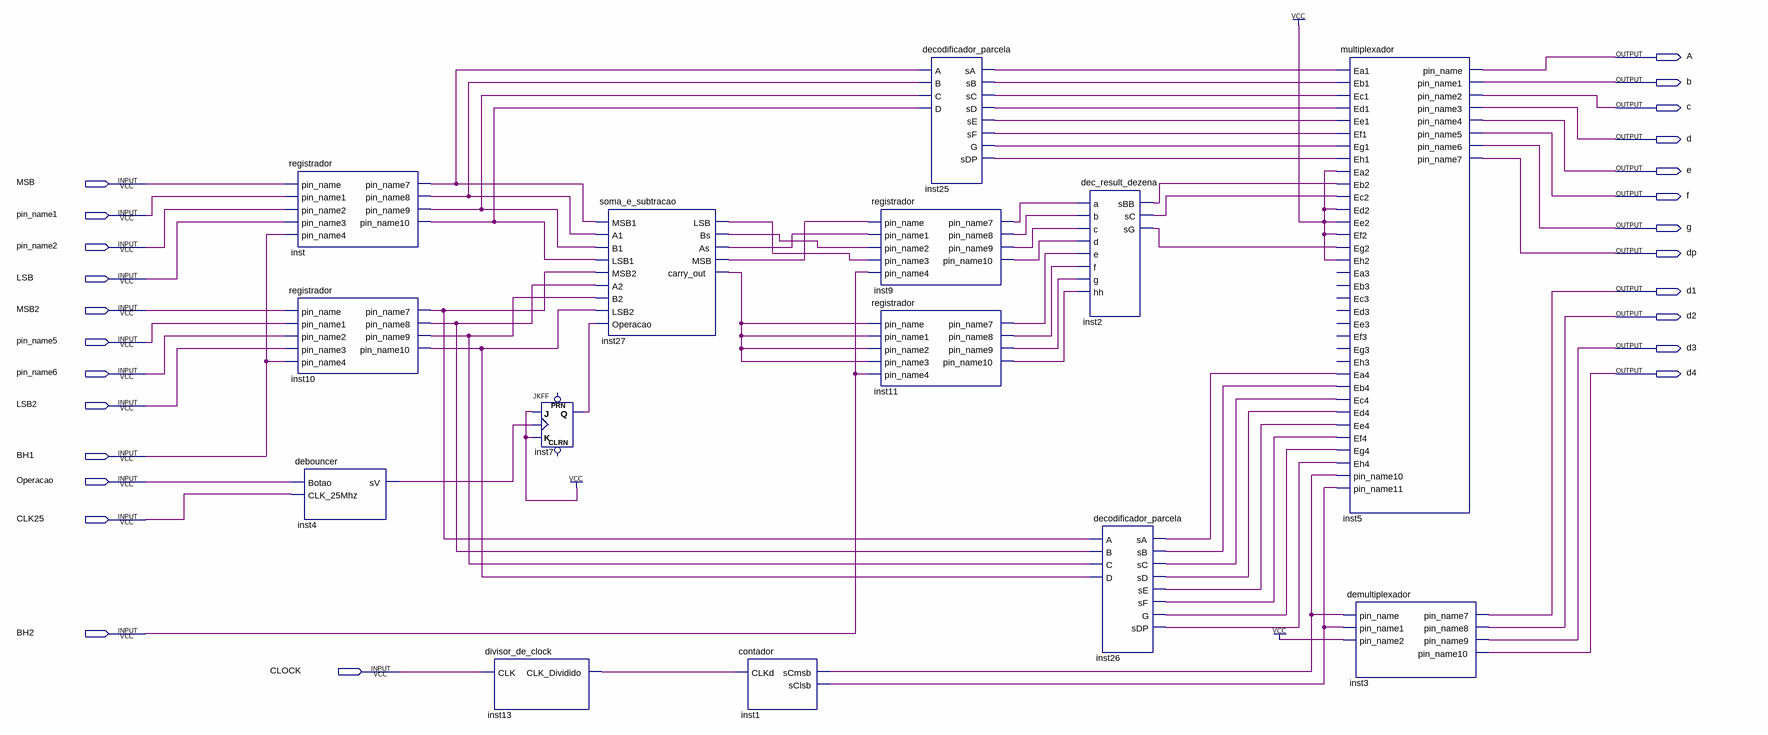
[diagram p0: schematic sheet]
// Quartus schematic calculadora_binaria.bdf as structural Verilog: 14 symbols, 25 pins
module calculadora_binaria (
  input  MSB,
  input  pin_name1,
  input  pin_name2,
  input  LSB,
  input  MSB2,
  input  pin_name5,
  input  pin_name6,
  input  LSB2,
  input  BH1,
  input  Operacao,
  input  CLK25,
  input  BH2,
  input  CLOCK,
  output A,
  output b,
  output c,
  output d,
  output e,
  output f,
  output g,
  output dp,
  output d1,
  output d2,
  output d3,
  output d4
);

  wire inst1_sclsb, inst1_scmsb, inst2_sbb, inst2_sc, inst2_sg, inst4_sv, inst7_q, inst9_pin_name7,
       inst9_pin_name8, inst9_pin_name9, inst9_pin_name10, inst10_pin_name7, inst10_pin_name8,
       inst10_pin_name9, inst10_pin_name10, inst11_pin_name7, inst11_pin_name8, inst11_pin_name9,
       inst11_pin_name10, inst13_clk_dividido, inst25_g, inst25_sa, inst25_sb, inst25_sc, inst25_sd,
       inst25_sdp, inst25_se, inst25_sf, inst26_g, inst26_sa, inst26_sb, inst26_sc, inst26_sd, inst26_sdp,
       inst26_se, inst26_sf, inst27_as, inst27_bs, inst27_carry_out, inst27_lsb, inst27_msb, inst_pin_name7,
       inst_pin_name8, inst_pin_name9, inst_pin_name10;

  registrador inst (
    .pin_name(MSB), .pin_name1(pin_name1), .pin_name2(pin_name2), .pin_name3(LSB), .pin_name4(BH1),
    .pin_name7(inst_pin_name7), .pin_name8(inst_pin_name8), .pin_name9(inst_pin_name9),
    .pin_name10(inst_pin_name10));
  registrador inst10 (
    .pin_name(MSB2), .pin_name1(pin_name5), .pin_name2(pin_name6), .pin_name3(LSB2), .pin_name4(BH1),
    .pin_name7(inst10_pin_name7), .pin_name8(inst10_pin_name8), .pin_name9(inst10_pin_name9),
    .pin_name10(inst10_pin_name10));
  debouncer inst4 (.Botao(Operacao), .CLK_25Mhz(CLK25), .sV(inst4_sv));
  divisor_de_clock inst13 (.CLK(CLOCK), .CLK_Dividido(inst13_clk_dividido));
  JKFF inst7 (.K(1'b1), .J(1'b1), .CLK(inst4_sv), .Q(inst7_q));  // open: PRN, CLRN
  soma_e_subtracao inst27 (
    .MSB1(inst_pin_name7), .A1(inst_pin_name8), .B1(inst_pin_name9), .LSB1(inst_pin_name10),
    .MSB2(inst10_pin_name7), .A2(inst10_pin_name8), .B2(inst10_pin_name9), .LSB2(inst10_pin_name10),
    .Operacao(inst7_q), .LSB(inst27_lsb), .Bs(inst27_bs), .As(inst27_as), .MSB(inst27_msb),
    .carry_out(inst27_carry_out));
  contador inst1 (.CLKd(inst13_clk_dividido), .sCmsb(inst1_scmsb), .sClsb(inst1_sclsb));
  registrador inst9 (
    .pin_name(inst27_msb), .pin_name1(inst27_as), .pin_name2(inst27_bs), .pin_name3(inst27_lsb),
    .pin_name4(BH2), .pin_name7(inst9_pin_name7), .pin_name8(inst9_pin_name8), .pin_name9(inst9_pin_name9),
    .pin_name10(inst9_pin_name10));
  registrador inst11 (
    .pin_name(inst27_carry_out), .pin_name1(inst27_carry_out), .pin_name2(inst27_carry_out),
    .pin_name3(inst27_carry_out), .pin_name4(BH2), .pin_name7(inst11_pin_name7),
    .pin_name8(inst11_pin_name8), .pin_name9(inst11_pin_name9), .pin_name10(inst11_pin_name10));
  decodificador_parcela inst25 (
    .A(inst_pin_name7), .B(inst_pin_name8), .C(inst_pin_name9), .D(inst_pin_name10), .sA(inst25_sa),
    .sB(inst25_sb), .sC(inst25_sc), .sD(inst25_sd), .sE(inst25_se), .sF(inst25_sf), .G(inst25_g),
    .sDP(inst25_sdp));
  dec_result_dezena inst2 (
    .a(inst9_pin_name7), .b(inst9_pin_name8), .c(inst9_pin_name9), .d(inst9_pin_name10),
    .e(inst11_pin_name7), .f(inst11_pin_name8), .g(inst11_pin_name9), .hh(inst11_pin_name10),
    .sBB(inst2_sbb), .sC(inst2_sc), .sG(inst2_sg));
  decodificador_parcela inst26 (
    .A(inst10_pin_name7), .B(inst10_pin_name8), .C(inst10_pin_name9), .D(inst10_pin_name10), .sA(inst26_sa),
    .sB(inst26_sb), .sC(inst26_sc), .sD(inst26_sd), .sE(inst26_se), .sF(inst26_sf), .G(inst26_g),
    .sDP(inst26_sdp));
  multiplexador inst5 (
    .Ea1(inst25_sa), .Eb1(inst25_sb), .Ec1(inst25_sc), .Ed1(inst25_sd), .Ee1(inst25_se), .Ef1(inst25_sf),
    .Eg1(inst25_g), .Eh1(inst25_sdp), .Ea2(1'b1), .Eb2(inst2_sbb), .Ec2(inst2_sc), .Ed2(1'b1), .Ee2(1'b1),
    .Ef2(1'b1), .Eg2(inst2_sg), .Eh2(1'b1), .Ea4(inst26_sa), .Eb4(inst26_sb), .Ec4(inst26_sc),
    .Ed4(inst26_sd), .Ee4(inst26_se), .Ef4(inst26_sf), .Eg4(inst26_g), .Eh4(inst26_sdp),
    .pin_name10(inst1_scmsb), .pin_name11(inst1_sclsb), .pin_name(A), .pin_name1(b), .pin_name2(c),
    .pin_name3(d), .pin_name4(e), .pin_name5(f), .pin_name6(g), .pin_name7(dp));  // open: Ea3, Eb3, Ec3, Ed3, Ee3, Ef3, Eg3, Eh3
  demultiplexador inst3 (
    .pin_name(inst1_scmsb), .pin_name1(inst1_sclsb), .pin_name2(1'b1), .pin_name7(d1), .pin_name8(d2),
    .pin_name9(d3), .pin_name10(d4));
endmodule
